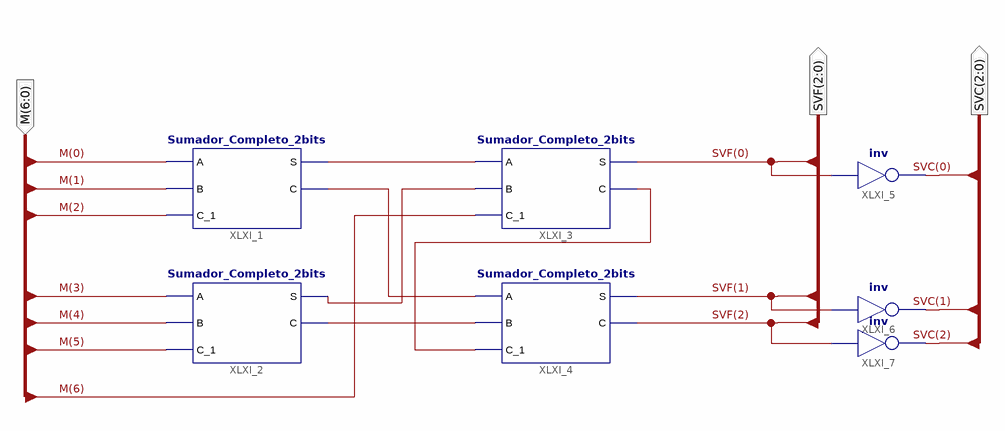
[diagram p0: schematic sheet 1]
// Xilinx ISE schematic Cuenta_Votos.sch (spartan6) as structural Verilog: 7 symbols, 3 ports
module Cuenta_Votos (
  input  [6:0] M,
  output [2:0] SVF,
  output [2:0] SVC
);

  wire XLXN_8, XLXN_9, XLXN_10, XLXN_11, XLXN_12;

  Sumador_Completo_2bits XLXI_1 (.A(M[0]), .B(M[1]), .C(XLXN_10), .C_1(M[2]), .S(XLXN_8));
  Sumador_Completo_2bits XLXI_2 (.A(M[3]), .B(M[4]), .C(XLXN_9), .C_1(M[5]), .S(XLXN_11));
  Sumador_Completo_2bits XLXI_3 (.A(XLXN_8), .B(XLXN_11), .C(XLXN_12), .C_1(M[6]), .S(SVF[0]));
  Sumador_Completo_2bits XLXI_4 (.A(XLXN_10), .B(XLXN_9), .C(SVF[2]), .C_1(XLXN_12), .S(SVF[1]));
  not XLXI_5 (SVC[0], SVF[0]);
  not XLXI_6 (SVC[1], SVF[1]);
  not XLXI_7 (SVC[2], SVF[2]);
endmodule
